# Altium schematic sheet top_aux_l.SchDoc
size A4; SheetNumber: 5; SheetTotal: 8
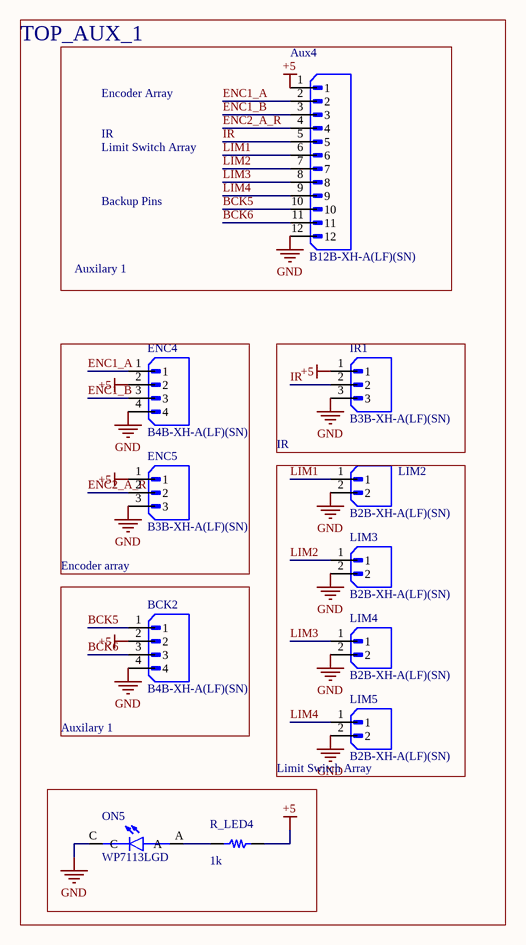
[diagram p0: top_aux_l.SchDoc]

## Parts
Aux4  B12B-XH-A(LF)(SN)  [JST_B12B-XH-A(LF)(SN)]
BCK2  B4B-XH-A(LF)(SN)  [JST_B4B-XH-A(LF)(SN)]
ENC4  B4B-XH-A(LF)(SN)  [JST_B4B-XH-A(LF)(SN)]
ENC5  B3B-XH-A(LF)(SN)  [JST_B3B-XH-A(LF)(SN)]
IR1  B3B-XH-A(LF)(SN)  [JST_B3B-XH-A(LF)(SN)]
LIM2  B2B-XH-A(LF)(SN)  [JST_B2B-XH-A(LF)(SN)]
LIM3  B2B-XH-A(LF)(SN)  [JST_B2B-XH-A(LF)(SN)]
LIM4  B2B-XH-A(LF)(SN)  [JST_B2B-XH-A(LF)(SN)]
LIM5  B2B-XH-A(LF)(SN)  [JST_B2B-XH-A(LF)(SN)]
ON5  WP7113LGD  [LED_WP7113LGD]
R_LED4  1k  [generic_res_footprint]

## Blocks framed on the sheet
TOP_AUX_1: Aux4 BCK2 LIM2-LIM5
Encoder array: ENC4 ENC5
IR: IR1
Limit Switch Array: ON5 R_LED4

## Nets
+5: Aux4.1 BCK2.2 ENC4.2 ENC5.1 IR1.1 R_LED4.2
GND: Aux4.12 BCK2.4 ENC4.4 ENC5.3 IR1.3 LIM2.2 LIM3.2 LIM4.2 LIM5.2 ON5.C
BCK5: Aux4.10 BCK2.1
BCK6: Aux4.11 BCK2.3
ENC1_A: Aux4.2 ENC4.1
ENC1_B: Aux4.3 ENC4.3
ENC2_A_R: Aux4.4 ENC5.2
IR: Aux4.5 IR1.2
LIM1: Aux4.6 LIM2.1
LIM2: Aux4.7 LIM3.1
LIM3: Aux4.8 LIM4.1
LIM4: Aux4.9 LIM5.1
NetON5_A: ON5.A R_LED4.1

## Notes on the sheet
- Encoder Array
- IR
- Limit Switch Array
- Backup Pins
- Auxilary 1

## Library data of the parts
Aux4 = CMP-398-000513-1: Connector Header Through Hole 12 position 0.098 (2.50mm); MF: JST Sales; Package: None; SnapEDA_Link: https://www.snapeda.com/parts/B12B-XH-A(LF)(SN)/JST+Sales+America+Inc./view-part/?ref=snap; Source: B12B-XH-A(LF)(SN).SchLib; Check_prices: https://www.snapeda.com/parts/B12B-XH-A(LF)(SN)/JST+Sales+America+Inc./view-part/?ref=eda; Value: *; Design Item ID: B12B-XH-A(LF)(SN); MP: B12B-XH-A(LF)(SN); Pin Count: 12; Component Type: Standard
BCK2 ENC4 = CMP-328-000000-1: Connector Header Through Hole 4 position 0.098 (2.50mm); MF: JST Sales; Pin Count: 4; Value: *; Check_prices: https://www.snapeda.com/parts/B4B-XH-A(LF)(SN)/JST+Sales+America+Inc./view-part/?ref=eda; SnapEDA_Link: https://www.snapeda.com/parts/B4B-XH-A(LF)(SN)/JST+Sales+America+Inc./view-part/?ref=snap; MP: B4B-XH-A(LF)(SN); Source: B4B-XH-A(LF)(SN).SchLib; Package: None; Component Type: Standard; Design Item ID: B4B-XH-A(LF)(SN)
ENC5 IR1 = CMP-330-000000-1: Connector Header Through Hole 3 position 0.098 (2.50mm); MF: JST Sales; Value: *; Check_prices: https://www.snapeda.com/parts/B3B-XH-A(LF)(SN)/JST+Sales+America+Inc./view-part/?ref=eda; Component Type: Standard; Source: B3B-XH-A(LF)(SN).SchLib; MP: B3B-XH-A(LF)(SN); Design Item ID: B3B-XH-A(LF)(SN); SnapEDA_Link: https://www.snapeda.com/parts/B3B-XH-A(LF)(SN)/JST+Sales+America+Inc./view-part/?ref=snap; Pin Count: 3; Package: None
LIM2-LIM5 = CMP-332-000000-1: Connector Header Through Hole 2 position 0.098 (2.50mm); MF: JST Sales America Inc.; Component Type: Standard; Value: *; Check_prices: https://www.snapeda.com/parts/B2B-XH-A(LF)(SN)/JST+Sales+America+Inc./view-part/?ref=eda; Package: None; MP: B2B-XH-A(LF)(SN); SnapEDA_Link: https://www.snapeda.com/parts/B2B-XH-A(LF)(SN)/JST+Sales+America+Inc./view-part/?ref=snap; Pin Count: 2; Source: B2B-XH-A(LF)(SN).SchLib; Design Item ID: B2B-XH-A(LF)(SN)
ON5 = CMP-352-000000-1: Green 568nm LED Indication - Discrete 1.9V Radial; MF: Kingbright; Value: *; Component Type: Standard; Design Item ID: WP7113LGD; Package: Radial Kingbright; Price: None; Source: WP7113LGD.SchLib; SnapEDA_Link: https://www.snapeda.com/parts/WP7113LGD/Kingbright/view-part/?ref=snap; Check_prices: https://www.snapeda.com/parts/WP7113LGD/Kingbright/view-part/?ref=eda; Pin Count: 2; Availability: In Stock; Purchase-URL: https://pricing.snapeda.com/search/part/WP7113LGD/?ref=eda; MP: WP7113LGD
R_LED4 = CMP-340-000000-2: Generic through hole resistor